# Altium schematic sheet old amplifer can delete.SchDoc
size A; SheetNumber: 4; SheetTotal: 5
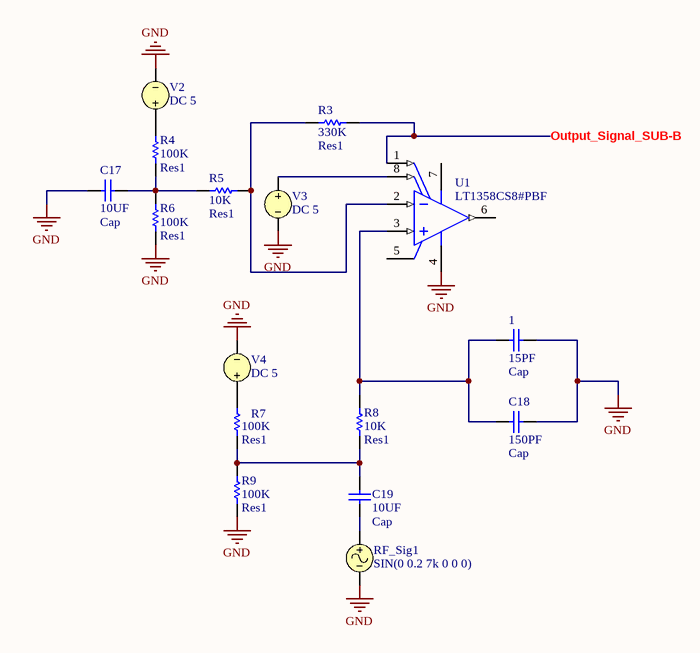
[diagram p0: old amplifer can delete.SchDoc]

## Parts
1  Cap  value 15PF  [RADIAL-0.1]
C17  Cap  value 10UF  [RADIAL-0.1]
C18  Cap  value 150PF  [RADIAL-0.1]
C19  Cap  value 10UF  [RADIAL-0.1]
R3  Res1  value 330K  [AXIAL-0.1-RES]
R4  Res1  value 100K  [AXIAL-0.1-RES]
R5  Res1  value 10K  [AXIAL-0.1-RES]
R6  Res1  value 100K  [AXIAL-0.1-RES]
R7  Res1  value 100K  [AXIAL-0.1-RES]
R8  Res1  value 10K  [AXIAL-0.1-RES]
R9  Res1  value 100K  [AXIAL-0.1-RES]
RF_Sig1  SIN(0 0.2 7k 0 0 0)
U1  LT1358CS8#PBF  [LT-S8-8_M]
V2  DC 5
V3  DC 5
V4  DC 5

## Nets
GND: 1.2 C17.1 C18.1 R6.1 R9.1 RF_Sig1.2 U1.4(V-) V2.2 V3.2 V4.2
Output_Signal_SUB-B: R3.2 U1.1(NULL)
Net1_1: 1.1 C18.2 R8.2 U1.3(+IN)
NetC17_2: C17.2 R4.1 R5.1 R6.2
NetC19_1: C19.1 RF_Sig1.1
NetC19_2: C19.2 R7.1 R8.1 R9.2
NetR3_1: R3.1 R5.2 U1.2(-IN)
NetR4_2: R4.2 V2.1
NetR7_2: R7.2 V4.1
NetU1_8: U1.8(NULL) V3.1

Not connected (* = marked no-connect by the designer): U1 5(NC) 6(VOUT) 7(V+)

## Library data of the parts
1 = CAP CER 15PF 50V C0G/NP0 RADIAL: Capacitor; Manufacturer Part Number: K150J15C0GF5TL2; Designator: C?; Voltage Rating: 50V; Published: 8-Jun-2000; LatestRevisionDate: 17-Jul-2002; LatestRevisionNote: Re-released for DXP Platform.; Publisher: Altium Limited
C17 C19 = CAP ALUM 10UF 20% 63V RADIAL: Capacitor; Manufacturer Part Number: ESK106M063AC3FA; Designator: C?; Voltage Rating: 63V; Published: 8-Jun-2000; LatestRevisionDate: 17-Jul-2002; LatestRevisionNote: Re-released for DXP Platform.; Publisher: Altium Limited
C18 = CAP CER 150PF 50V C0G/NP0 RADIAL: Capacitor; Manufacturer Part Number: K151J15C0GF53L2; Designator: C?; Voltage Rating: 50V; Published: 8-Jun-2000; LatestRevisionDate: 17-Jul-2002; LatestRevisionNote: Re-released for DXP Platform.; Publisher: Altium Limited
R3 = RES 330K OHM 5% 1/4W AXIAL: Resistor; Manufacturer Part Number: CFR-25JB-52-330K; Designator: R?; Power Rating: 1/4W; Tolerance: 0.05; Published: 8-Jun-2000; LatestRevisionDate: 17-Jul-2002; LatestRevisionNote: Re-released for DXP Platform.; Publisher: Altium Limited
R4 R6 R7 R9 = RES 100K OHM 5% 1/4W AXIAL: Resistor; Manufacturer Part Number: CFR-25JB-52-100K; Designator: R?; Power Rating: 1/4W; Tolerance: 0.05; Published: 8-Jun-2000; LatestRevisionDate: 17-Jul-2002; LatestRevisionNote: Re-released for DXP Platform.; Publisher: Altium Limited
R5 R8 = RES 10K OHM 5% 1/4W AXIAL: Resistor; Manufacturer Part Number: CFR-25JB-52-10K; Designator: R?; Power Rating: 1/4W; Tolerance: 0.05; Published: 8-Jun-2000; LatestRevisionDate: 17-Jul-2002; LatestRevisionNote: Re-released for DXP Platform.; Publisher: Altium Limited
RF_Sig1 = VSIN: Sinusoidal Voltage Source; Note: PCB Footprint - Not required; Offset: 0; Amplitude: 0.2; AC Magnitude: 1; Published: 8-Jun-2000; LatestRevisionDate: 15-Nov-2004; LatestRevisionNote: Corrected Netlist.; PackageReference: Not Applicable; Publisher: Altium Limited; Frequency: 7k; Delay: 0; Damping Factor: 0; Phase: 0; DC Magnitude: 0; AC Phase: 0
U1 = CMP-0359-02713-2: Dual Channel, High Speed Precision Operational Amplifier, 25 MHz Typical GBW, 600 V/us Typical SR, 5 to 36 V, 8-Pin SOIC (S8-8), Commerical, Pb-Free; Manufacturer: Linear Technology; Linear Technology Part Number: LT1358; Vos (mV) Typical: 0.2; Vs Min (V): 5; Channels (#): 2; SR (V/us) Typical: 600; GBW (MHz) Typical: 25; Vs Max (V): 36; Mounting Technology: Surface Mount; ComponentLink3URL: http://cds.linear.com/docs/en/packaging/05081610_G_SO8.pdf; ComponentLink2URL: http://cds.linear.com/docs/en/datasheet/135859fb.pdf; Is (mA) Typical: 2; DatasheetVersion: Rev. B; ComponentLink1URL: http://www.linear.com/; Type: VFB; RoHS: Pb-Free; ComponentLink3Description: Package Specification; ComponentLink1Description: Manufacturer URL; RevisionNote: URLs updated; PackageReference: LT-S8-8; PackageVersion: Rev G; PartNumber: LT1358CS8#PBF; PackageDescription: 8-Pin Plastic Small Outline, Body 4.9 x 3.9 mm, Pitch 1.27 mm; ComponentLink2Description: Datasheet
V2-V4 = VSRC: Voltage Source; Note: PCB Footprint - Not required; AC Magnitude: 1; AC Phase: 0; Value: 5; Published: 8-Jun-2000; LatestRevisionDate: 17-Jul-2002; LatestRevisionNote: Re-released for DXP Platform.; PackageReference: Not Applicable; Publisher: Altium Limited